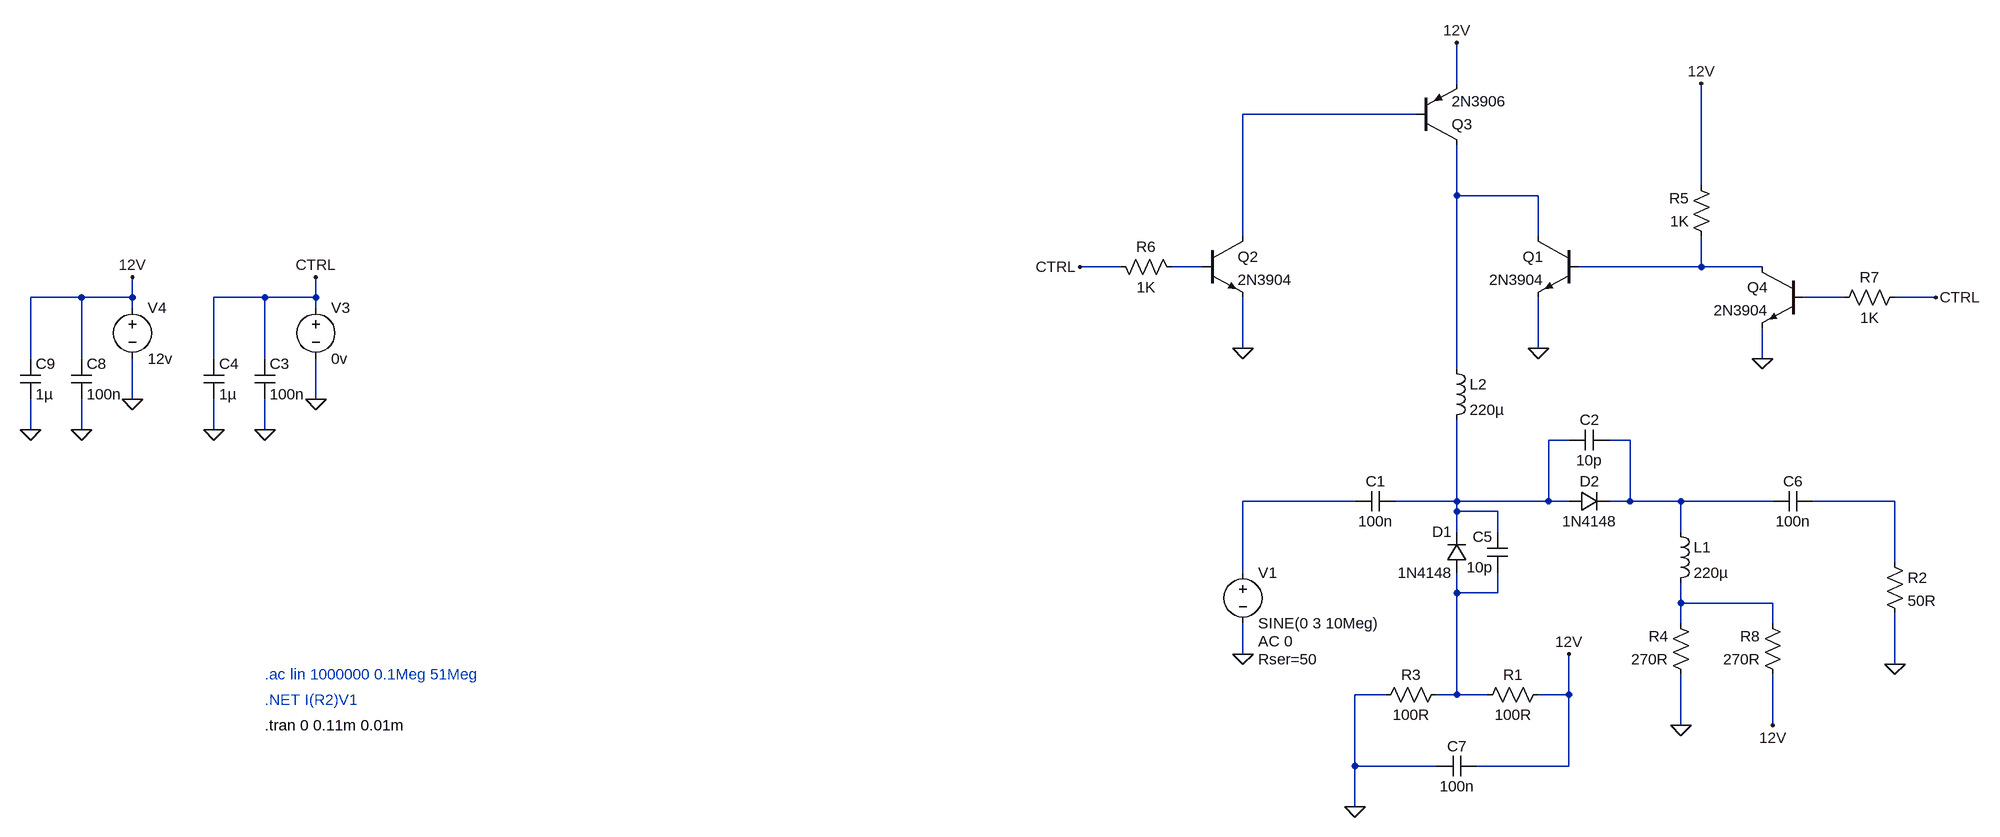
[diagram p0: schematic wspr_si5351_output_router.asc]
wspr_si5351_output_router.asc, the LTspice schematic file:
Version 4
SHEET 1 1352 680
WIRE 400 -672 400 -736
WIRE 336 -624 64 -624
WIRE 784 -512 784 -672
WIRE 400 -496 400 -576
WIRE 528 -496 400 -496
WIRE 64 -432 64 -624
WIRE 528 -432 528 -496
WIRE -128 -384 -192 -384
WIRE 0 -384 -48 -384
WIRE 784 -384 784 -432
WIRE 784 -384 592 -384
WIRE 880 -384 784 -384
WIRE -1760 -336 -1840 -336
WIRE -1680 -336 -1680 -368
WIRE -1680 -336 -1760 -336
WIRE -1472 -336 -1552 -336
WIRE -1392 -336 -1392 -368
WIRE -1392 -336 -1472 -336
WIRE 1008 -336 944 -336
WIRE 1152 -336 1088 -336
WIRE -1680 -320 -1680 -336
WIRE -1392 -320 -1392 -336
WIRE 64 -256 64 -336
WIRE 528 -256 528 -336
WIRE -1840 -240 -1840 -336
WIRE -1760 -240 -1760 -336
WIRE -1552 -240 -1552 -336
WIRE -1472 -240 -1472 -336
WIRE 880 -240 880 -288
WIRE 400 -224 400 -496
WIRE -1680 -176 -1680 -240
WIRE -1392 -176 -1392 -240
WIRE -1840 -128 -1840 -176
WIRE -1760 -128 -1760 -176
WIRE -1552 -128 -1552 -176
WIRE -1472 -128 -1472 -176
WIRE 576 -112 544 -112
WIRE 672 -112 640 -112
WIRE 240 -16 64 -16
WIRE 400 -16 400 -144
WIRE 400 -16 304 -16
WIRE 544 -16 544 -112
WIRE 544 -16 400 -16
WIRE 576 -16 544 -16
WIRE 672 -16 672 -112
WIRE 672 -16 640 -16
WIRE 752 -16 672 -16
WIRE 896 -16 752 -16
WIRE 1088 -16 960 -16
WIRE 400 0 400 -16
WIRE 464 0 400 0
WIRE 400 32 400 0
WIRE 464 32 464 0
WIRE 752 32 752 -16
WIRE 1088 80 1088 -16
WIRE 64 96 64 -16
WIRE 400 128 400 96
WIRE 464 128 464 96
WIRE 464 128 400 128
WIRE 752 144 752 112
WIRE 896 144 752 144
WIRE 752 176 752 144
WIRE 896 176 896 144
WIRE 64 224 64 176
WIRE 1088 240 1088 160
WIRE 288 288 240 288
WIRE 400 288 400 128
WIRE 400 288 368 288
WIRE 448 288 400 288
WIRE 576 288 576 224
WIRE 576 288 528 288
WIRE 752 336 752 256
WIRE 896 336 896 256
WIRE 240 400 240 288
WIRE 368 400 240 400
WIRE 576 400 576 288
WIRE 576 400 432 400
WIRE 240 464 240 400
FLAG 64 224 0
FLAG -1392 -176 0
FLAG -1552 -128 0
FLAG -1472 -128 0
FLAG 1088 240 0
FLAG -1392 -368 CTRL
FLAG 576 224 12V
FLAG 752 336 0
FLAG 240 464 0
FLAG -1680 -176 0
FLAG -1840 -128 0
FLAG -1760 -128 0
FLAG -1680 -368 12V
FLAG 528 -256 0
FLAG 64 -256 0
FLAG 400 -736 12V
FLAG 784 -672 12V
FLAG 880 -240 0
FLAG -192 -384 CTRL
FLAG 1152 -336 CTRL
FLAG 896 336 12V
SYMBOL voltage 64 80 R0
WINDOW 123 24 124 Left 2
WINDOW 39 24 152 Left 2
SYMATTR Value2 AC 0
SYMATTR SpiceLine Rser=50
SYMATTR InstName V1
SYMATTR Value SINE(0 3 10Meg)
SYMBOL cap 304 -32 R90
WINDOW 0 0 32 VBottom 2
WINDOW 3 32 32 VTop 2
SYMATTR InstName C1
SYMATTR Value 100n
SYMBOL ind 384 -240 R0
SYMATTR InstName L2
SYMATTR Value 220µ
SYMBOL diode 416 96 R180
WINDOW 0 24 64 Left 2
WINDOW 3 24 0 Left 2
SYMATTR InstName D1
SYMATTR Value 1N4148
SYMBOL voltage -1392 -336 R0
WINDOW 123 0 0 Left 0
WINDOW 39 0 0 Left 0
SYMATTR InstName V3
SYMATTR Value 0v
SYMBOL cap -1488 -240 R0
SYMATTR InstName C3
SYMATTR Value 100n
SYMBOL cap -1568 -240 R0
SYMATTR InstName C4
SYMATTR Value 1µ
SYMBOL res 1072 64 R0
SYMATTR InstName R2
SYMATTR Value 50R
SYMBOL res 544 272 R90
WINDOW 0 0 56 VBottom 2
WINDOW 3 32 56 VTop 2
SYMATTR InstName R1
SYMATTR Value 100R
SYMBOL res 384 272 R90
WINDOW 0 0 56 VBottom 2
WINDOW 3 32 56 VTop 2
SYMATTR InstName R3
SYMATTR Value 100R
SYMBOL diode 576 0 R270
WINDOW 0 32 32 VTop 2
WINDOW 3 0 32 VBottom 2
SYMATTR InstName D2
SYMATTR Value 1N4148
SYMBOL ind 736 16 R0
SYMATTR InstName L1
SYMATTR Value 220µ
SYMBOL res 768 272 R180
WINDOW 0 36 76 Left 2
WINDOW 3 36 40 Left 2
SYMATTR InstName R4
SYMATTR Value 270R
SYMBOL cap 640 -128 R90
WINDOW 0 0 32 VBottom 2
WINDOW 3 32 32 VTop 2
SYMATTR InstName C2
SYMATTR Value 10p
SYMBOL cap 480 96 R180
WINDOW 0 24 56 Left 2
WINDOW 3 24 8 Left 2
SYMATTR InstName C5
SYMATTR Value 10p
SYMBOL cap 960 -32 R90
WINDOW 0 0 32 VBottom 2
WINDOW 3 32 32 VTop 2
SYMATTR InstName C6
SYMATTR Value 100n
SYMBOL cap 432 384 R90
WINDOW 0 0 32 VBottom 2
WINDOW 3 32 32 VTop 2
SYMATTR InstName C7
SYMATTR Value 100n
SYMBOL voltage -1680 -336 R0
WINDOW 123 0 0 Left 0
WINDOW 39 0 0 Left 0
SYMATTR InstName V4
SYMATTR Value 12v
SYMBOL cap -1776 -240 R0
SYMATTR InstName C8
SYMATTR Value 100n
SYMBOL cap -1856 -240 R0
SYMATTR InstName C9
SYMATTR Value 1µ
SYMBOL npn 592 -432 M0
SYMATTR InstName Q1
SYMATTR Value 2N3904
SYMBOL res 800 -416 R180
WINDOW 0 36 76 Left 2
WINDOW 3 36 40 Left 2
SYMATTR InstName R5
SYMATTR Value 1K
SYMBOL npn 0 -432 R0
SYMATTR InstName Q2
SYMATTR Value 2N3904
SYMBOL res -144 -400 M90
WINDOW 0 0 56 VBottom 2
WINDOW 3 32 56 VTop 2
SYMATTR InstName R6
SYMATTR Value 1K
SYMBOL pnp 336 -576 M180
SYMATTR InstName Q3
SYMATTR Value 2N3906
SYMBOL npn 944 -384 M0
SYMATTR InstName Q4
SYMATTR Value 2N3904
SYMBOL res 1104 -352 R90
WINDOW 0 0 56 VBottom 2
WINDOW 3 32 56 VTop 2
SYMATTR InstName R7
SYMATTR Value 1K
SYMBOL res 912 272 R180
WINDOW 0 36 76 Left 2
WINDOW 3 36 40 Left 2
SYMATTR InstName R8
SYMATTR Value 270R
TEXT -1472 256 Left 2 ;.ac lin 1000000 0.1Meg 51Meg
TEXT -1472 296 Left 2 ;.NET I(R2)V1
TEXT -1472 336 Left 2 !.tran 0 0.11m 0.01m

The netlist it stands for:
* wspr_si5351_output_router.asc
V1 N008 0 SINE(0 3 10Meg) AC 0 Rser=50
C1 N006 N008 100n
L2 N002 N006 220µ
D1 N010 N006 1N4148
V3 CTRL 0 0v
C3 CTRL 0 100n
C4 CTRL 0 1µ
R2 N009 0 50R
R1 12V N010 100R
R3 N010 0 100R
D2 N006 N007 1N4148
L1 N007 N011 220µ
R4 0 N011 270R
C2 N007 N006 10p
C5 N010 N006 10p
C6 N009 N007 100n
C7 12V 0 100n
V4 12V 0 12v
C8 12V 0 100n
C9 12V 0 1µ
Q1 N002 N004 0 0 2N3904
R5 N004 12V 1K
Q2 N001 N003 0 0 2N3904
R6 CTRL N003 1K
Q3 N002 N001 12V 0 2N3906
Q4 N004 N005 0 0 2N3904
R7 CTRL N005 1K
R8 12V N011 270R
.model D D
.lib standard.dio
.model NPN NPN
.model PNP PNP
.lib standard.bjt
* .ac lin 1000000 0.1Meg 51Meg
* .NET I(R2)V1
.tran 0 0.11m 0.01m
.backanno
.end